# EAGLE schematic FluxCapacitorCPUMeter (EAGLE 6.0)
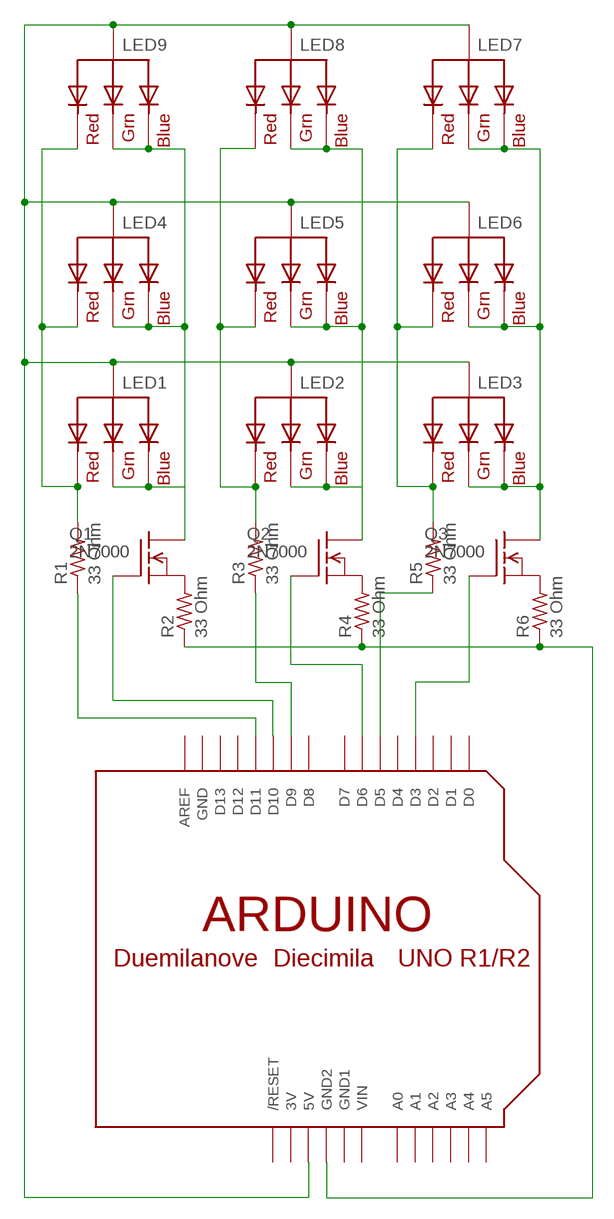
[diagram p0: schematic, sheet 1]

## Parts
LED1  RGBLED_CA-5MM  [LED5MMRGB]
LED2  RGBLED_CA-5MM  [LED5MMRGB]
LED3  RGBLED_CA-5MM  [LED5MMRGB]
LED4  RGBLED_CA-5MM  [LED5MMRGB]
LED5  RGBLED_CA-5MM  [LED5MMRGB]
LED6  RGBLED_CA-5MM  [LED5MMRGB]
LED7  RGBLED_CA-5MM  [LED5MMRGB]
LED8  RGBLED_CA-5MM  [LED5MMRGB]
LED9  RGBLED_CA-5MM  [LED5MMRGB]
Q1  2N7000  FQN1N50CI  [TO92-INLINE]
Q2  2N7000  FQN1N50CI  [TO92-INLINE]
Q3  2N7000  FQN1N50CI  [TO92-INLINE]
R1  33 Ohm  R-US_0207/10  [0207/10]
R2  33 Ohm  R-US_0207/10  [0207/10]
R3  33 Ohm  R-US_0207/10  [0207/10]
R4  33 Ohm  R-US_0207/10  [0207/10]
R5  33 Ohm  R-US_0207/10  [0207/10]
R6  33 Ohm  R-US_0207/10  [0207/10]
U$1  ARDUINOUNO  [ARDUINO]

## Nets
N$1: Q1.2(G) U$1.D10
N$2: Q3.2(G) U$1.D3
N$3: R5.1 U$1.D5
N$4: Q2.3(S) R4.2
N$5: R3.1 U$1.D9
N$6: LED1.3(GREEN) LED1.4(BLUE) LED4.3(GREEN) LED4.4(BLUE) LED9.3(GREEN) LED9.4(BLUE) Q1.1(D)
N$7: R1.1 U$1.D11
N$8: LED1.1(RED) LED4.1(RED) LED9.1(RED) R1.2
N$9: LED1.2(VCC) LED2.2(VCC) LED3.2(VCC) LED4.2(VCC) LED5.2(VCC) LED6.2(VCC) LED7.2(VCC) LED8.2(VCC) LED9.2(VCC) U$1.5V
N$10: LED3.3(GREEN) LED3.4(BLUE) LED6.3(GREEN) LED6.4(BLUE) LED7.3(GREEN) LED7.4(BLUE) Q3.1(D)
N$11: R2.1 R4.1 R6.1 U$1.GND2
N$12: LED3.1(RED) LED6.1(RED) LED7.1(RED) R5.2
N$13: Q1.3(S) R2.2
N$14: LED2.1(RED) LED5.1(RED) LED8.1(RED) R3.2
N$15: Q2.2(G) U$1.D6
N$16: LED2.3(GREEN) LED2.4(BLUE) LED5.3(GREEN) LED5.4(BLUE) LED8.3(GREEN) LED8.4(BLUE) Q2.1(D)
N$17: Q3.3(S) R6.2
Unconnected: U$1.A0 U$1.A1 U$1.A2 U$1.A3 U$1.A4 U$1.A5 U$1.AREF U$1.D0 U$1.D1 U$1.D2 U$1.D4 U$1.D7 U$1.D8 U$1.D12 U$1.D13 U$1.RESET(/RESET)

## Power pins joined to a net without a drawn wire
3V: U$1.3V
GND: U$1.GND
GND1: U$1.GND1
VIN: U$1.VIN

## Library data of the parts
LED1-LED9 = adafruit:RGBLED_CA: RGB LED, common-anode 5MM Staggered pins 5mm Piranha package http://www.ladyada.net/library/pcb/eaglelibrary.html
Q1-Q3 = adafruit:FQN1N50C: N-Channel Enhancement MOSFET 500V, 0.4A, 6.0 Ohm
R1-R6 = adafruit:R-US_: RESISTOR, American symbol
U$1 = adafruit:ARDUINO: Arduino Diecimila/Duemilanove Make a shield with ease, this package has all the named pins as well as the two mounting drill holes and an outline of the USB and DC power connector. The outline is on the DIMENSION layer, so if your board house uses it they will cut the outline to match. http://www.ladyada.net/library/pcb/eaglelibrary.html